# EAGLE design JugendNetzteil (EAGLE 8.5.0)
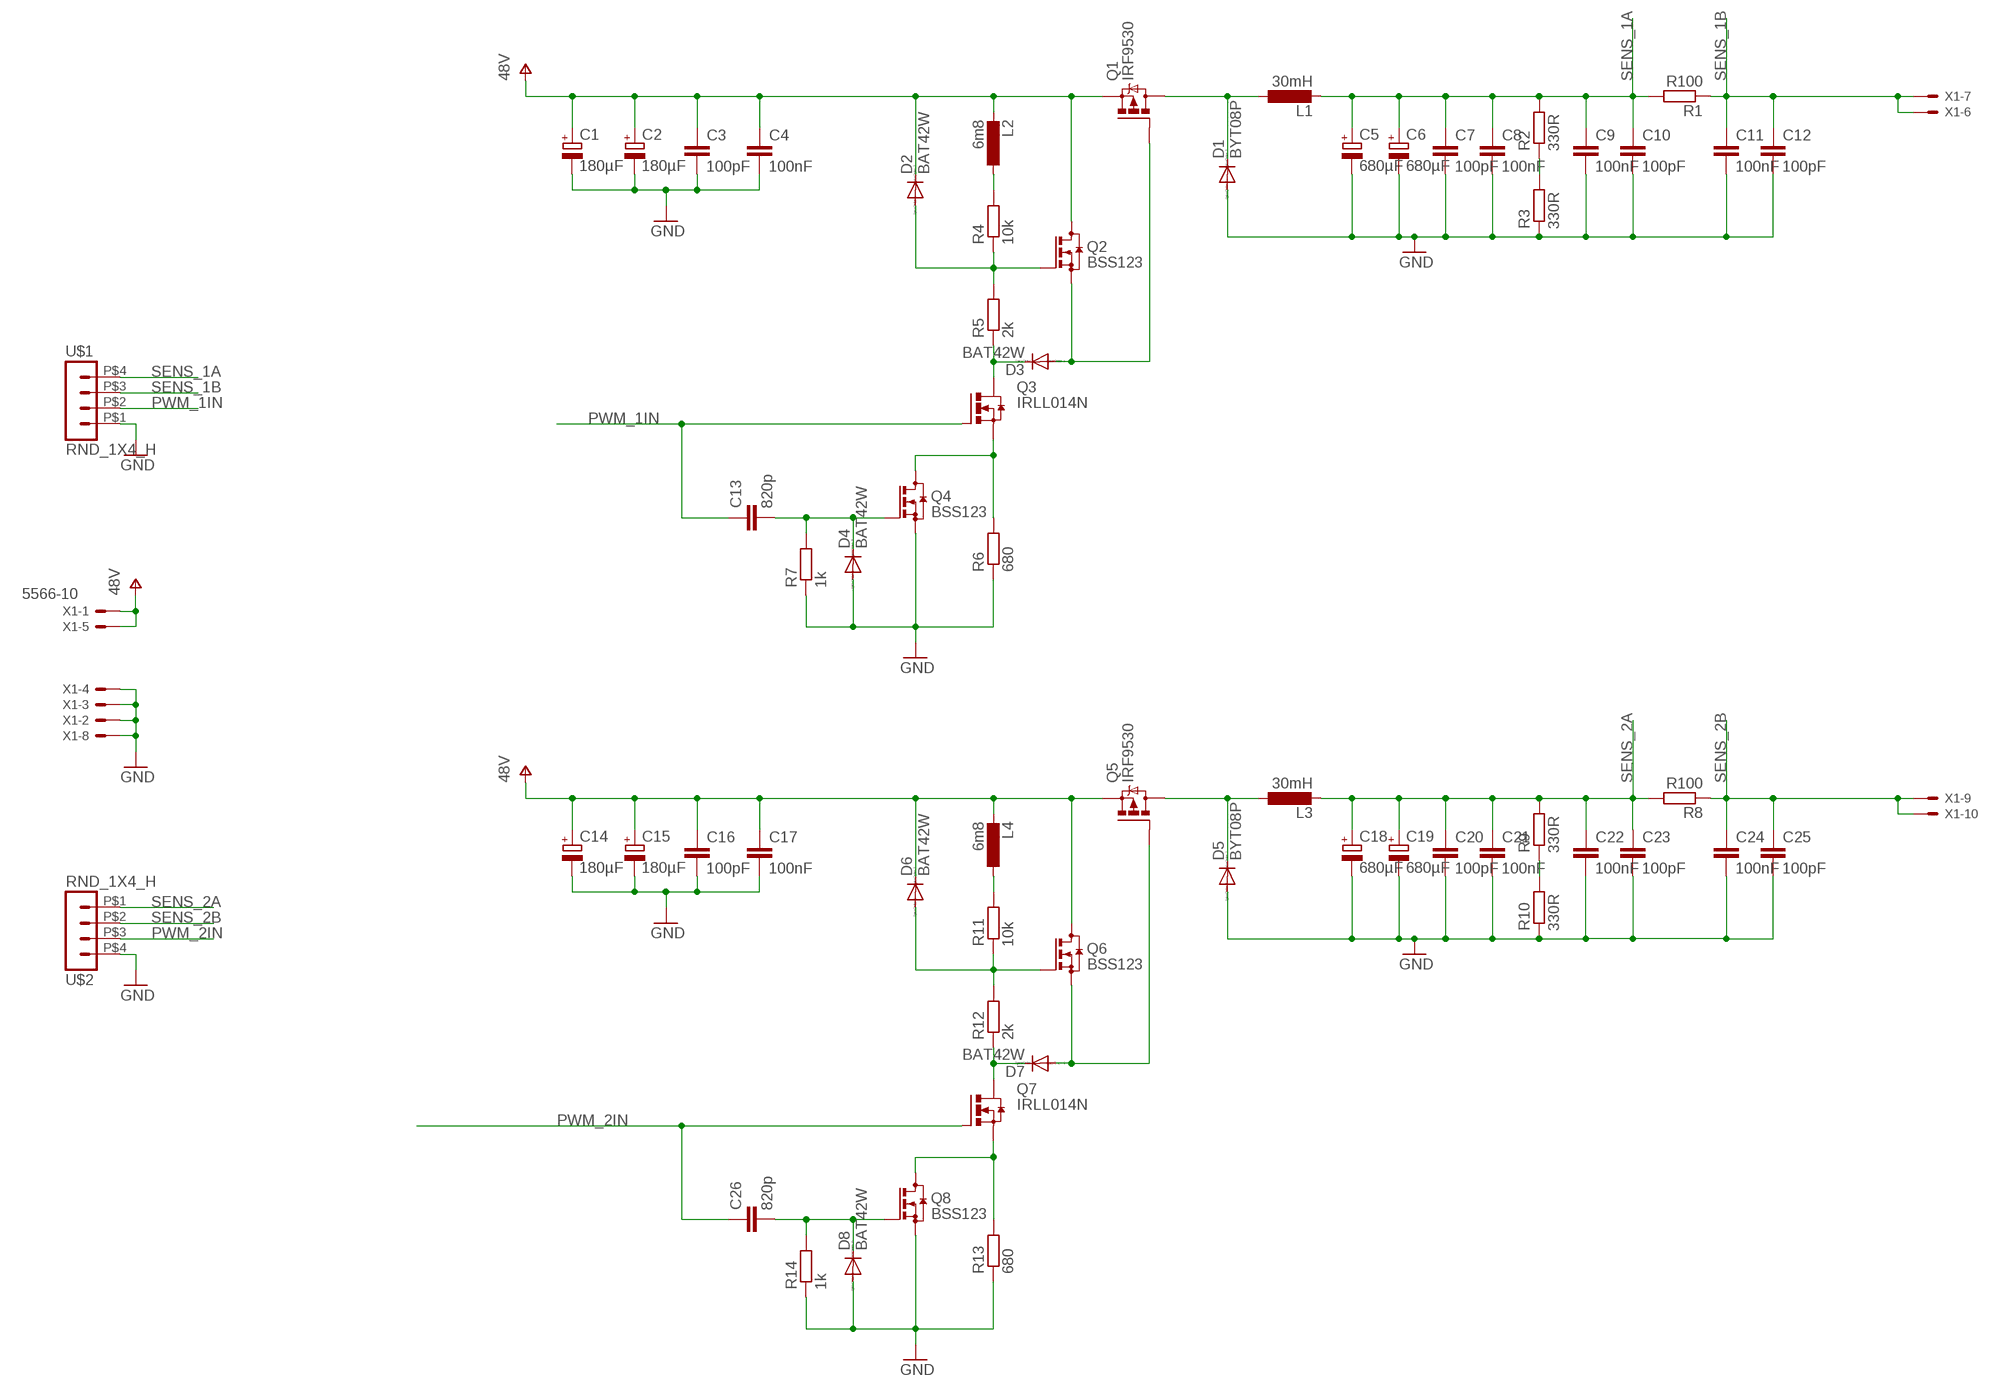
[diagram p0: schematic, sheet 1]

## Parts
C1  180µF  CPOL-EUE3.5-8  [E3,5-8]
C2  180µF  CPOL-EUE3.5-8  [E3,5-8]
C3  100pF  C-EUC0805  [C0805]
C4  100nF  C-EUC0805  [C0805]
C5  680µF  CPOL-EUTT5D11  [TT5D11]
C6  680µF  CPOL-EUTT5D11  [TT5D11]
C7  100pF  C-EUC0805  [C0805]
C8  100nF  C-EUC0805  [C0805]
C9  100nF  C-EUC0805  [C0805]
C10  100pF  C-EUC0805  [C0805]
C11  100nF  C-EUC0805  [C0805]
C12  100pF  C-EUC0805  [C0805]
C13  820p  C-EUC0805  [C0805]
C14  180µF  CPOL-EUE3.5-8  [E3,5-8]
C15  180µF  CPOL-EUE3.5-8  [E3,5-8]
C16  100pF  C-EUC0805  [C0805]
C17  100nF  C-EUC0805  [C0805]
C18  680µF  CPOL-EUTT5D11  [TT5D11]
C19  680µF  CPOL-EUTT5D11  [TT5D11]
C20  100pF  C-EUC0805  [C0805]
C21  100nF  C-EUC0805  [C0805]
C22  100nF  C-EUC0805  [C0805]
C23  100pF  C-EUC0805  [C0805]
C24  100nF  C-EUC0805  [C0805]
C25  100pF  C-EUC0805  [C0805]
C26  820p  C-EUC0805  [C0805]
D1  BYT08P  [TO220ACS]
D2  BAT42W  DIODE-SOD123  [SOD123]
D3  BAT42W  DIODE-SOD123  [SOD123]
D4  BAT42W  DIODE-SOD123  [SOD123]
D5  BYT08P  [TO220ACS]
D6  BAT42W  DIODE-SOD123  [SOD123]
D7  BAT42W  DIODE-SOD123  [SOD123]
D8  BAT42W  DIODE-SOD123  [SOD123]
L1  30mH  L-EUTJ8-U1  [TJ8-U1]
L2  6m8  L-EU2200-15.24  [2200-15.24]
L3  30mH  L-EUTJ8-U1  [TJ8-U1]
L4  6m8  L-EU2200-15.24  [2200-15.24]
Q1  IRF9530  [TO220BV]
Q2  BSS123  [SOT23]
Q3  IRLL014N  N-HEXFET-2D_SOT232-  [SOT223]
Q4  BSS123  [SOT23]
Q5  IRF9530  [TO220BV]
Q6  BSS123  [SOT23]
Q7  IRLL014N  N-HEXFET-2D_SOT232-  [SOT223]
Q8  BSS123  [SOT23]
R1  R100  R-EU_0617/5V  [0617V]
R2  330R  R-EU_0414/5V  [0414V]
R3  330R  R-EU_0414/5V  [0414V]
R4  10k  R-EU_R0805  [R0805]
R5  2k  R-EU_R0805  [R0805]
R6  680  R-EU_R0805  [R0805]
R7  1k  R-EU_R0805  [R0805]
R8  R100  R-EU_0617/5V  [0617V]
R9  330R  R-EU_0414/5V  [0414V]
R10  330R  R-EU_0414/5V  [0414V]
R11  10k  R-EU_R0805  [R0805]
R12  2k  R-EU_R0805  [R0805]
R13  680  R-EU_R0805  [R0805]
R14  1k  R-EU_R0805  [R0805]
U$1  RND_1X4_H  [RND_1X4_H]
U$2  RND_1X4_H  [RND_1X4_H]
X1  5566-10  [5566-10]

## Nets
GND: C1.- C2.- C3.2 C4.2 C5.- C6.- C7.2 C8.2 C9.2 C10.2 C11.2 C12.2 C14.- C15.- C16.2 C17.2 C18.- C19.- C20.2 C21.2 C22.2 C23.2 C24.2 C25.2 D1.A D4.A D5.A D8.A Q4.2(S) Q8.2(S) R3.1 R6.1 R7.1 R10.1 R13.1 R14.1 U$1.P$1 U$2.P$4 X1.2 X1.3 X1.4 X1.8
N$1: C13.2 D4.C Q4.1(G) R7.2
N$2: L2.1 R4.2
N$4: D1.C L1.1 Q1.D
N$5: D3.A Q1.G Q2.2(S)
N$6: D3.C Q3.2(D) Q3.4(D) R5.1
N$7: D2.A Q2.1(G) R4.1 R5.2
N$9: Q3.3(S) Q4.3(D) R6.2
N$10: D6.A Q6.1(G) R11.1 R12.2
N$13: L4.1 R11.2
N$14: R2.1 R3.2
N$15: D7.A Q5.G Q6.2(S)
N$16: D7.C Q7.2(D) Q7.4(D) R12.1
N$18: D5.C L3.1 Q5.D
N$19: C26.2 D8.C Q8.1(G) R14.2
N$21: Q7.3(S) Q8.3(D) R13.2
N$24: R9.1 R10.2
PWM_1IN: C13.1 Q3.1(G) U$1.P$2
PWM_2IN: C26.1 Q7.1(G) U$2.P$3
SENS_1A: C5.+ C6.+ C7.1 C8.1 C9.1 C10.1 L1.2 R1.2 R2.2 U$1.P$4
SENS_1B: C11.1 C12.1 R1.1 U$1.P$3 X1.6 X1.7
SENS_2A: C18.+ C19.+ C20.1 C21.1 C22.1 C23.1 L3.2 R8.2 R9.2 U$2.P$1
SENS_2B: C24.1 C25.1 R8.1 U$2.P$2 X1.9 X1.10
V+: C1.+ C2.+ C3.1 C4.1 C14.+ C15.+ C16.1 C17.1 D2.C D6.C L2.2 L4.2 Q1.S Q2.3(D) Q5.S Q6.3(D) X1.1 X1.5 ; supply symbol labelled 48V

## Library data of the parts
C1 C2 C5 C6 C14 C15 C18 C19 = resistor:CPOL-EU: POLARIZED CAPACITOR, European symbol
C3 C4 C7-C13 C16 C17 C20-C26 = resistor:C-EU: CAPACITOR, European symbol
D1 D5 = diode:BYT08P: DIODE ultra fast
D2-D4 D6-D8 = diode:DIODE-: DIODE
L1-L4 = resistor:L-EU: INDUCTOR, European symbol
Q1 Q5 = transistor-power:IRF9530: P-CHANNEL HEXFET POWER-MOS-FET Source: http://www.irf.com/product-info/datasheets/data/irf9530.pdf
Q2 Q4 Q6 Q8 = transistor-small-signal:BSS123: N-CHANNEL MOS FET
Q3 Q7 = transistor-power:N-HEXFET-2D_?-*: HEXFET® Power MOSFET 2 Drain connects http://www.irf.com/product-info/datasheets/data/irll014n.pdf
R1-R14 = resistor:R-EU_: RESISTOR, European symbol
U$1 U$2 = con-rnd:RND_1X4_H
X1 = con-molex:5566-10: Mini FIT connector 10 pol Source: http://www.molex.com; OC_FARNELL: unknown; OC_NEWARK: unknown

## Net classes
0 default: width 0.33 mm, drill 0.33 mm, clearance 0.33 mm

## Board
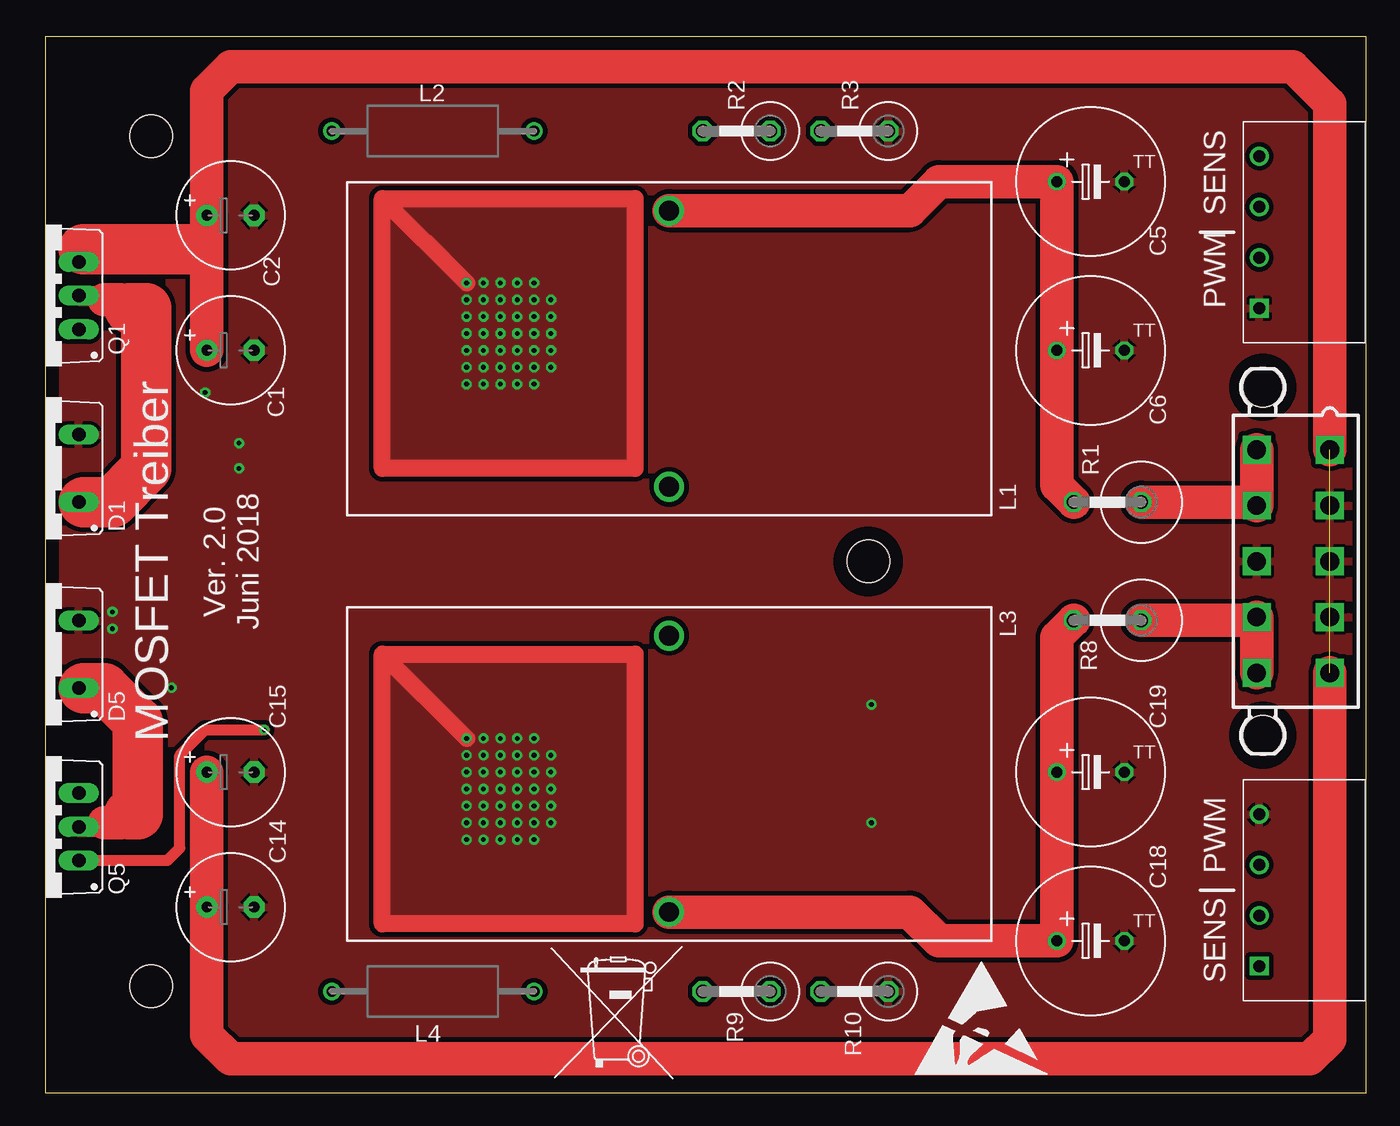
[diagram p1: board, top side]
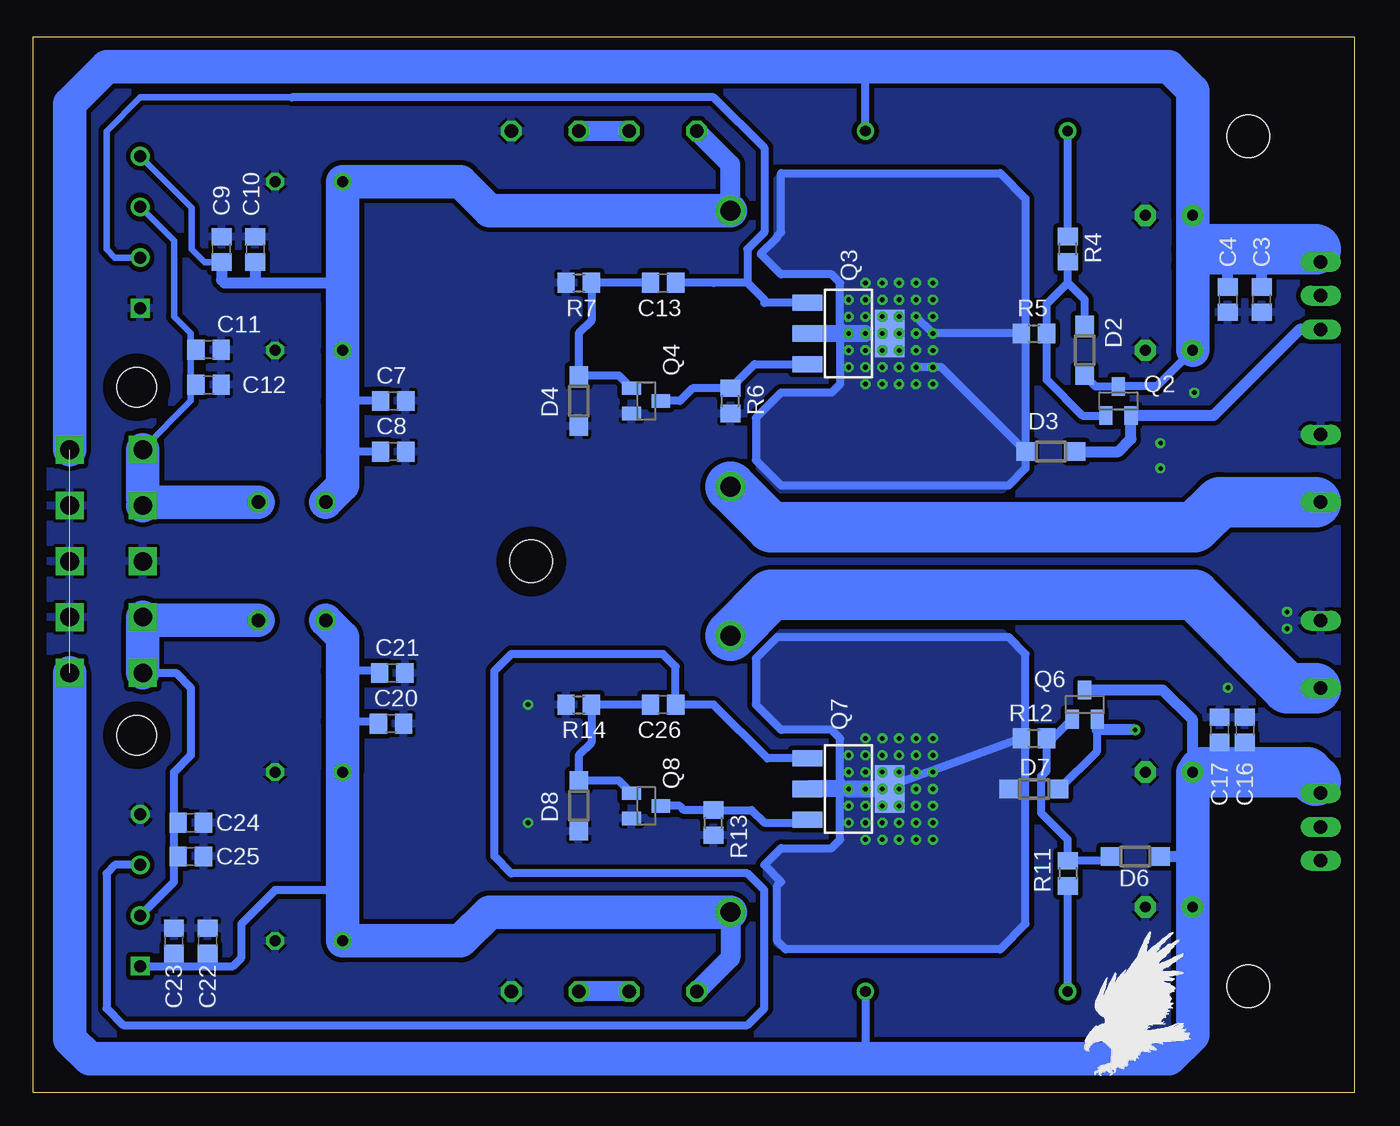
[diagram p2: board, bottom side, seen from below]

Size 99.5 x 79.5 mm. Coordinates in mm from the lower left corner, seen from the top.
Outline: 0,0 99.5,0 99.5,79.5 0,79.5 0,0
Copper layers (1*16): Top 0.035mm / dielectric 1.5mm / Bottom 0.035mm
Design rules "default *": minimum track width 12mil, minimum drill 0.35mm, track to track 14mil, track to pad 14mil, pad to pad 14mil, via to via 14mil, smd to smd 14mil, copper to edge 40mil, drill to drill 14mil, minimum pad ring 10mil, minimum via ring 8mil, stop-mask expansion 4mil, vias tented up to drill 0mil, thermal gap 10mil
Holes 3.2 mm at 8,8 8,72 62,40

### Footprints (pad centres in the part's own frame; a part is rotated, then mirrored left to right if it is on the bottom)
E3,5-8 = drill 0.813 pad 1.6: + -1.778,0 | drill 0.813 pad 1.6 octagon: - 1.778,0
C0805 = smd 1.3 x 1.5: 1 -0.95,0; 2 0.95,0
TT5D11 = drill 0.813: + -2.54,0 | drill 0.813 octagon: - 2.54,0
TO220ACS = drill 1.016 long: A 2.54,-2.54; C -2.54,-2.54
SOD123 = smd 1.4 x 1.4: A 1.9,0; C -1.9,0
TJ8-U1 = drill 1.5: 1 -10.4,0; 2 10.4,0
2200-15.24 = drill 0.8 pad 1.27: 1 -7.62,0; 2 7.62,0
TO220BV = drill 1.016 long: D 0,-2.54; G -2.54,-2.54; S 2.54,-2.54
SOT23 = smd 1 x 1.4: 1 -0.95,-1.1; 2 0.95,-1.1; 3 0,1.1
SOT223 = smd 1.219 x 2.235: 1 -2.311,-3.099; 2 0,-3.099; 3 2.311,-3.099 | smd 3.6 x 2.2: 4 0,3.099
0617V = drill 1.016 octagon: 1 -2.54,0; 2 2.54,0
0414V = drill 1.016 octagon: 1 -2.54,0; 2 2.54,0
R0805 = smd 1.3 x 1.5: 1 -0.95,0; 2 0.95,0
RND_1X4_H = drill 0.9 square: P$1 -5.715,0 | drill 0.9: P$2 -1.905,0; P$3 1.905,0; P$4 5.715,0
5566-10 = drill 1.4 square: 1 8.4,-2.75; 2 4.2,-2.75; 3 0,-2.75; 4 -4.2,-2.75; 5 -8.4,-2.75; 6 8.4,2.75; 7 4.2,2.75; 8 0,2.75; 9 -4.2,2.75; 10 -8.4,2.75 | hole 3: 13.1,2.29; -13.1,2.29

### Placement (x,y rotation side)
C1  13.97,66.04 0 top
C2  13.97,55.88 0 top
C3  6.99,59.69 270 bottom
C4  9.53,59.69 270 bottom
C5  78.74,68.58 0 top
C6  78.74,55.88 0 top
C7  72.39,52.07 0 bottom
C8  72.39,48.26 0 bottom
C9  85.31,63.48 90 bottom
C10  82.78,63.48 90 bottom
C11  86.29,55.93 0 bottom
C12  86.29,53.28 0 bottom
C13  52.07,60.96 180 bottom
C14  13.97,13.97 0 top
C15  13.97,24.13 0 top
C16  8.26,27.3 90 bottom
C17  10.16,27.3 90 bottom
C18  78.74,11.43 0 top
C19  78.74,24.13 0 top
C20  72.56,27.78 0 bottom
C21  72.46,31.59 0 bottom
C22  86.36,11.43 90 bottom
C23  88.9,11.43 90 bottom
C24  87.63,20.32 0 bottom
C25  87.63,17.78 0 bottom
C26  52.07,29.21 180 bottom
D1  0,47 90 top
D2  20.32,55.88 90 bottom
D3  22.86,48.26 0 bottom
D4  58.42,52.07 270 bottom
D5  0,33 90 top
D6  16.51,17.78 180 bottom
D7  24.13,22.86 0 bottom
D8  58.42,21.59 270 bottom
L1  47,56 90 top
L2  29.21,72.39 0 top
L3  47,24 270 top
L4  29.21,7.62 0 top
Q1  0,60 90 top
Q2  17.78,52.07 0 bottom
Q3  38.1,57.15 270 bottom
Q4  53.34,52.07 270 bottom
Q5  0,20 90 top
Q6  20.32,29.21 0 bottom
Q7  38.1,22.86 270 bottom
Q8  53.34,21.59 270 bottom
R1  80.01,44.45 180 top
R2  52.07,72.39 180 top
R3  60.96,72.39 180 top
R4  21.59,63.5 90 bottom
R5  24.13,57.15 0 bottom
R6  46.99,52.07 90 bottom
R7  58.42,60.96 0 bottom
R8  80.01,35.56 180 top
R9  52.07,7.62 180 top
R10  60.96,7.62 180 top
R11  21.59,16.51 270 bottom
R12  24.13,26.67 0 bottom
R13  48.26,20.32 90 bottom
R14  58.42,29.21 0 bottom
U$1  91.44,64.77 90 top
U$2  91.44,15.24 90 top
U$3  [EAGLE-PLC-8MM]  20.32,1.27 0 bottom
U$4  [ESD_10.00]  65.41,1.27 0 top
U$5  [MUELLTONNE_10.00]  37.47,0.64 0 top
X1  94,40 90 top

### Tracks (layer width: path | path; a pad name or v marks a point on that pad's centre or on a via)
GND  (via drill 0.35)
  other vias: 12.06,52.7 14.61,46.99 14.61,48.9 62.23,29.21 62.23,20.32 9.53,30.48 5.08,34.92 5.08,36.2
  pour Top (isolate 0.305): 0.5,79 99,79 99,0.5 0.5,0.5
  pour Bottom (isolate 0.305): 0.5,79 99,79 99,0.5 0.5,0.5
N$1
  Bottom 0.61: C13.2 R7.2 57.47,58.1 58.42,57.15 D4.C 55.39,53.97 Q4.1
N$2
  Bottom 0.61: R4.2 L2.1
N$4
  Top 1.524: 2.92,44.46 D1.C | Q1.D 4.14,60 4.45,59.69
  Top 2.54: 6.35,59.05 5.71,59.69 4.45,59.69
  Top 3.81: 2.92,44.46 5.09,44.46 7.62,46.99 7.62,59.05 6.35,59.05
  Bottom 1.524: 2.92,44.46 D1.C
  Bottom 3.81: L1.1 43.95,42.55 12.06,42.55 10.15,44.46 2.92,44.46
N$5
  Bottom 0.813: D3.A 17.78,48.26 16.83,49.21 Q2.2 10.62,50.97 4.13,57.46 Q1.G
N$6  (via drill 0.35)
  Top 1.27: v31.75,60.96 25.4,67.31 | 25.4,67.31 44.45,67.31 44.45,46.99 25.4,46.99 25.4,67.31
  Bottom 0.61: R5.1 v31.75,57.15 v33.02,58.42 | D3.C 31.11,54.61 v31.75,54.61 v33.02,54.61 | v38.1,57.15 38.73,57.78 | 38.73,57.78 38.73,60.96 39.37,61.59 43.18,61.59 44.72,63.13 43.48,64.37 43.48,64.47 43.18,64.77 43.18,69.22 26.67,69.22 24.77,67.31 24.77,57.47 R5.1 | 38.73,57.78 38.73,53.34 39.37,52.7 43.18,52.7 45.09,50.8 45.09,47.62 43.18,45.72 26.04,45.72 24.77,46.99 24.77,56.84 R5.1
  Bottom 1.27: Q3.2 v38.1,57.15 v36.83,57.15
  other vias: 33.02,59.69 34.29,59.69 35.56,59.69 34.29,58.42 35.56,58.42 36.83,58.42 36.83,59.69 36.83,55.88 36.83,54.61 35.56,57.15 34.29,57.15 33.02,57.15 33.02,55.88 34.29,55.88 35.56,55.88 35.56,54.61 34.29,54.61 33.02,60.96 34.29,60.96 35.56,60.96 36.83,60.96 31.75,59.69 31.75,58.42 31.75,55.88 31.75,53.34 33.02,53.34 34.29,53.34 35.56,53.34 36.83,53.34 38.1,54.61 38.1,55.88 38.1,58.42 38.1,59.69
  pour Bottom (no thermals): 38.1,53.34 38.1,60.96 39.37,62.23 43.18,62.23 44.45,63.5 44.45,67.31 43.18,68.58 26.67,68.58 25.4,67.31 25.4,46.99 26.67,45.72 43.18,45.72 44.45,46.99 44.45,50.8 43.18,52.07 39.37,52.07
  pour Top (no thermals): 43.18,67.31 25.4,67.31 25.4,46.99 44.45,46.99 44.45,67.31
N$7
  Bottom 0.61: 21.59,60.96 R4.1 | 21.59,60.96 23.18,59.37 R5.2 23.18,53.66 20.49,50.97 Q2.1 | D2.A 20.32,59.69 21.59,60.96
N$9
  Bottom 0.61: Q3.3 45.17,54.84 R6.2 49.85,53.02 50.8,52.07 Q4.3
N$10
  Bottom 0.61: R11.1 21.59,19.05 23.59,21.05 23.59,23.83 23.18,24.24 R12.2 22.71,26.67 Q6.1 | 21.27,17.78 R11.1 | D6.A 18.73,17.46 R11.1
N$13
  Bottom 0.61: L4.1 R11.2
N$14
  Bottom 1.524: R2.1 R3.2
N$15  (via drill 0.35)
  Top 0.813: Q5.G 9.21,17.46 10.16,18.41 10.16,25.4 12.06,27.3 v16.51,27.3
  Bottom 0.61: D7.A 19.37,25.72 19.37,27.3
  Bottom 0.813: v16.51,27.3 19.37,27.3 Q6.2
N$16  (via drill 0.35)
  Top 1.27: v31.75,26.67 25.4,33.02 | 25.4,33.02 44.45,33.02 44.45,12.7 25.4,12.7 25.4,33.02
  Bottom 0.61: R12.1 v35.56,22.86 | v38.1,22.86 38.73,23.5 38.73,26.67 39.37,27.3 43.18,27.3 45.09,29.21 45.09,32.69 43.48,34.29 26.04,34.29 24.77,33.02 24.77,12.7 26.67,10.79 42.85,10.79 43.48,11.43 43.48,15.57 43.18,15.88 44.45,17.14 43.18,18.41 39.37,18.41 38.73,19.05 38.73,22.86
  Bottom 1.27: 38.73,22.86 Q7.2 | v38.1,22.86 v36.83,22.86 v35.56,22.86 Q7.4
  other vias: 33.02,26.67 34.29,26.67 35.56,26.67 36.83,26.67 33.02,25.4 34.29,25.4 35.56,25.4 36.83,25.4 38.1,25.4 33.02,24.13 34.29,24.13 35.56,24.13 36.83,24.13 38.1,24.13 33.02,22.86 33.02,21.59 33.02,20.32 33.02,19.05 34.29,19.05 34.29,20.32 34.29,21.59 34.29,22.86 35.56,20.32 35.56,19.05 35.56,21.59 36.83,21.59 36.83,20.32 36.83,19.05 38.1,20.32 38.1,21.59 31.75,25.4 31.75,24.13 31.75,22.86 31.75,21.59 31.75,20.32 31.75,19.05
  pour Bottom (no thermals): 38.1,22.86 38.1,26.67 39.37,27.94 43.18,27.94 44.45,29.21 44.45,33.02 43.18,34.29 26.67,34.29 25.4,33.02 25.4,22.86 25.4,12.7 26.67,11.43 43.18,11.43 44.45,12.7 44.45,16.51 43.18,17.78 39.37,17.78 38.1,19.05
  pour Top (isolate 0.61, no thermals): 43.18,12.7 25.4,12.7 25.4,33.02 44.45,33.02 44.45,12.7
N$18
  Top 1.524: 2.92,30.46 D5.C | Q5.D 4.14,20 4.46,20.32
  Top 2.54: 6.99,20.95 5.71,20.95 | 6.35,20.95 5.71,20.32 4.46,20.32 4.45,20.31
  Top 3.81: 2.92,30.46 4.46,30.46 6.99,27.94 6.99,20.95 6.35,20.95
  Bottom 1.27: D5.C 2.92,30.46
  Bottom 3.81: L3.1 43.94,37.47 12.06,37.47 5.06,30.46 2.92,30.46
N$19
  Bottom 0.61: Q8.1 55.39,23.49 D8.C 58.42,25.4 57.47,26.35 R14.2 C26.2
N$21
  Bottom 0.61: Q8.3 50.8,21.59 50.48,21.27 R13.2 45.4,21.27 44.45,20.32 41.43,20.32 Q7.3
N$24
  Bottom 1.524: R9.1 R10.2
PWM_1IN
  Bottom 0.508: 80.01,74.93 91.44,74.93 93.98,72.39 93.98,63.5 93.34,62.87 U$1.P$2
  Bottom 0.61: Q3.1 44.45,59.46 44.45,59.69 45.72,60.96 | 80.01,74.93 48.26,74.93 44.45,71.12 44.45,64.77 45.72,63.5 45.72,60.96 | 45.72,60.96 48.26,60.96 C13.1
PWM_2IN
  Bottom 0.61: 50.89,28.98 C26.1 | C26.1 48.26,29.21 44.22,25.17 Q7.1 | U$2.P$3 93.34,17.14 93.98,16.51 93.98,6.35 92.71,5.08 45.72,5.08 44.45,6.35 44.45,15.24 45.72,16.51 63.5,16.51 64.77,17.78 64.77,31.75 63.5,33.02 52.07,33.02 51.12,32.07 C26.1
SENS_1A
  Top 2.54: R1.2 76.2,45.72 C6.+ C5.+ 67.31,68.58 65.13,66.4 L1.2
  Bottom 0.508: C9.1 86.6,62.53 87.57,63.5 87.57,66.61 U$1.P$4
  Bottom 0.61: C7.1 76.2,52.07 | C8.1 76.2,48.26
  Bottom 0.813: 82.55,60.96 85.09,60.96 85.31,61.18 C9.1 | 82.55,60.96 76.2,60.96 | C10.1 82.78,61.19 82.55,60.96 | 75.89,59.38 76.2,59.69 | 75.75,55.43 C6.+
  Bottom 1.524: L1.2 47,69.86 R2.2
  Bottom 2.54: R1.2 76.2,45.72 76.2,48.26 76.2,52.07 C6.+ 76.2,59.69 76.2,60.96 C5.+ 67.31,68.58 65.13,66.4 L1.2
SENS_1B
  Top 2.54: R1.1 91,44.45 X1.7 X1.6
  Bottom 0.508: U$1.P$3 88.9,64.14 88.9,58.42 87.63,57.15 87.63,55.88 | 87.63,55.88 87.63,53.34 | 87.63,53.34 87.63,52.07 91.25,48.45 X1.6 | C11.1 87.29,55.88 87.63,55.88 | C12.1 87.57,53.28 87.63,53.34
  Bottom 2.54: 91,44.45 X1.7 | R1.1 91,44.45 | X1.6 91.25,44.7 91,44.45
SENS_2A
  Top 2.54: R8.2 76.2,34.29 C19.+ C18.+ 67.31,11.43 65.14,13.6 L3.2
  Bottom 0.61: C21.1 73.57,31.75 76.2,31.75 | C20.1 73.67,27.94 76.2,27.94 | 76.2,15.24 81.28,15.24 83.82,12.7 83.82,10.16 84.45,9.53 86.36,9.53 | U$2.P$1 88.9,9.53 | 88.9,9.53 86.36,9.53 | C22.1 86.36,9.53 | C23.1 88.9,9.53
  Bottom 1.524: L3.2 47,10.15 R9.2
  Bottom 2.54: R8.2 76.2,34.29 76.2,31.75 76.2,27.94 C19.+ 76.2,15.24 C18.+ 67.31,11.43 65.14,13.6 L3.2
SENS_2B
  Top 2.54: R8.1 91.01,35.56 X1.9 X1.10
  Bottom 0.61: U$2.P$2 88.9,15.88 88.9,17.78 | 88.9,17.78 88.9,20.32 | 88.9,20.32 88.9,24.13 87.63,25.4 87.63,30.48 88.75,31.6 X1.10 | C24.1 88.9,20.32 | C25.1 88.9,17.78
  Bottom 2.54: 91.01,35.56 X1.9 | R8.1 91.01,35.56 | X1.10 91.25,35.32 91.01,35.56
V+  (1 unrouted)
  Top 1.524: 11.88,62.54 12.19,62.23 | 2.92,63.5 2.54,63.5 Q1.S
  Top 2.54: 12.19,63.5 C1.+ 12.19,75.44 13.97,77.21 93.98,77.21 96.75,74.44 X1.1 | 12.19,63.5 12.19,62.23 C2.+ | X1.5 96.75,4.04 95.25,2.54 13.97,2.54 12.19,4.32 C14.+ C15.+ | 12.19,63.5 11.43,63.5
  Top 3.81: 11.43,63.5 2.92,63.5
  Bottom 0.61: C2.+ 14.9,53.17 Q2.3 19.51,53.17 D2.C | L2.2 36.83,77.21 | L4.2 36.83,2.54
  Bottom 0.813: 36.88,77.16 36.83,77.21 | D6.C 12.19,17.78 | C17.1 10.16,24.77 9.53,24.13 8.26,25.4 C16.1 | C15.+ 12.19,28.07 14.44,30.31 Q6.3 | C3.1 6.99,63.5 | C4.1 9.53,63.5
  Bottom 1.27: 2.92,63.5 2.92,62.54 Q1.S
  Bottom 1.524: 11.88,62.54 12.19,62.23 | Q5.S 3.56,23.56 3.56,24.13 | C15.+ 11.43,24.13
  Bottom 2.54: X1.5 96.75,4.04 95.25,2.54 36.83,2.54 13.97,2.54 12.19,4.32 C14.+ 12.19,17.78 C15.+ | 12.19,63.5 C1.+ 12.19,75.44 13.97,77.21 36.83,77.21 93.98,77.21 96.75,74.44 X1.1 | 12.19,63.5 12.19,62.23 C2.+ | 12.19,63.5 11.43,63.5
  Bottom 3.81: 11.43,24.13 9.53,24.13 3.56,24.13 2.92,23.5 | 11.43,63.5 9.53,63.5 6.99,63.5 2.92,63.5

### Text on the board
tNames: SENS | PWM | MOSFET Treiber | Ver. 2.0 / Juni 2018 | PWM | SENS